# Altium schematic sheet External Power Feed.SchDoc: External Power Feed
size A4
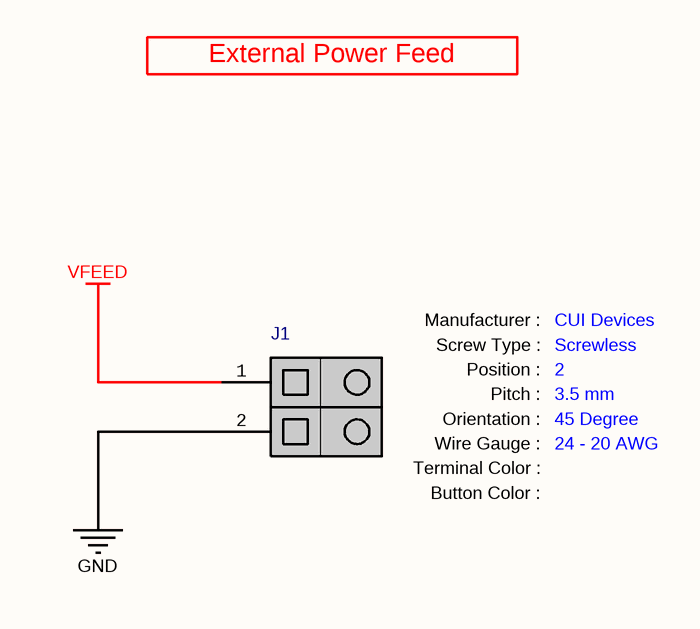
[diagram p0: External Power Feed.SchDoc]

## Parts
J1  Pitch: 3.5 mm  Manufacturer Name: CUI Devices  Position: 2  Screw Type: Screwless  Orientation: 45 Degree  Wire Gauge: 24 - 20 AWG  [TBL002A-350-02GY-2GY]  (hidden comment: Fixed Terminal Block)

## Nets
GND: J1.2(Pin-2)
VFEED: J1.1(Pin-1)

## Notes on the sheet
- External Power Feed
- Title
- Size:
- Date:
- A4
- Number:
- Time:
- Revision:
- Sheet
- of
- File:
- (in symbol Connector - Fixed Terminal Block (2 Pole 45Degre)) Manufacturer :; Screw Type :; Position :; Pitch :; Orientation :; Wire Gauge :; Terminal Color :; Button Color :

## Library data of the parts
J1 = Connector - Fixed Terminal Block (2 Pole 45Degre): Fixed Terminal Blocks Terminal block, screwless, 3.50, 45 , 2 poles, cool gray; Row: 1; Manufacturer Part Number: TBL002A-350-02GY-2GY; Mouser Part Number: 490-TBL002A3502GY2GY; ComponentLink1Description: DataSheet; ComponentLink1URL: https://www.mouser.com.tr/datasheet/2/670/tbl002a_350-1600859.pdf; ComponentLink2Description: Mouser; ComponentLink2URL: https://www.mouser.com.tr/ProductDetail/CUI-Devices/TBL002A-350-02GY-2GY/?qs=%2Fha2pyFadujrPvZITO3%2FnrmBdhdc%252BtnZMF1UJZZUjtr4sFVaDgEMMZG%252BoMytOXjZ; Supplier 1: Mouser; Supplier 2: Arrow Electronics; Supplier 3: Digi-Key; Supplier Part Number 3: 102-6367-ND; Supplier Part Number 2: TBL002A-350-02GY-2GY; Supplier Part Number 1: 490-TBL002A3502GY2GY